# Altium project dc-dc.PrjPcb
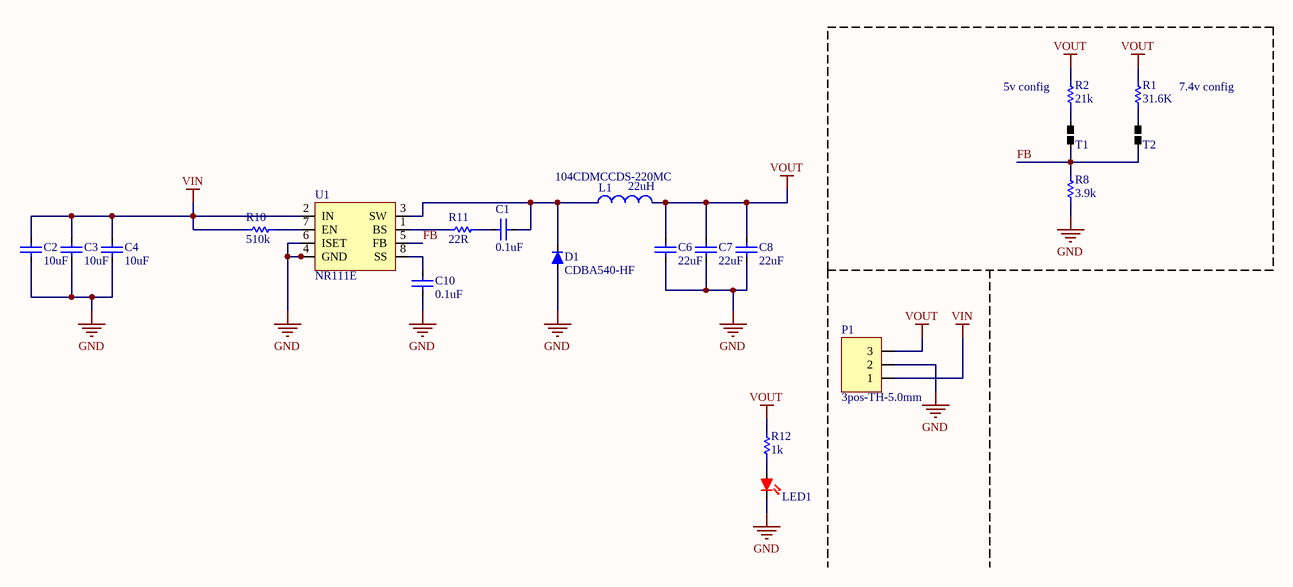
[diagram p0: Sheet1.SchDoc]
1 sheet, 21 parts. Net scope: global (net labels, ports and power ports of the same name join across sheets).
Board file: PCB1.PcbDoc

## Sheet Sheet1.SchDoc
size A4

### Parts
C1  value 0.1uF  [CAPACITOR-0603]  (hidden comment: Capacitor-0603-0.1uF-50V-X7R)
C2  value 10uF  [CAPACITOR-0805]  (hidden comment: Capacitor-0805-10uF-35V-X5R)
C3  value 10uF  [CAPACITOR-0805]  (hidden comment: Capacitor-0805-10uF-35V-X5R)
C4  value 10uF  [CAPACITOR-0805]  (hidden comment: Capacitor-0805-10uF-35V-X5R)
C6  value 22uF  [CAPACITOR-0805]  (hidden comment: Capacitor-0805-22uF-16V-X5R)
C7  value 22uF  [CAPACITOR-0805]  (hidden comment: Capacitor-0805-22uF-16V-X5R)
C8  value 22uF  [CAPACITOR-0805]  (hidden comment: Capacitor-0805-22uF-16V-X5R)
C10  value 0.1uF  [CAPACITOR-0603]  (hidden comment: Capacitor-0603-0.1uF-50V-X7R)
D1  CDBA540-HF  [SMA/DO-214AC]
L1  104CDMCCDS-220MC  value 22uH  [Inductor_22UH 5A]
LED1  B1911USD-20D000114U1930  [LED-0603-2PIN]  (value not drawn)
P1  3pos-TH-5.0mm  [Side Connector 3pins]
R1  value 31.6K  [Resistor-0603]  (hidden comment: SMT resistor)
R2  value 21k  [Resistor-0603]  (hidden comment: SMT resistor)
R8  value 3.9k  [Resistor-0603]  (hidden comment: SMT resistor)
R10  value 510k  [Resistor-0603]  (hidden comment: SMT resistor)
R11  value 22R  [Resistor-0603]  (hidden comment: SMT resistor)
R12  value 1k  [Resistor-0603]  (hidden comment: SMT resistor)
T1  NetTie_0402  [NetTie-0402]  (value not drawn)
T2  NetTie_0402  [NetTie-0402]  (value not drawn)
U1  NR111E  [SOIC-8-EXPOSED-PAD]

### Nets
GND: C2.1 C3.1 C4.1 C6.1 C7.1 C8.1 C10.2 D1.1(A) LED1.1(K) P1.2 R8.1 U1.4(GND) U1.6(ISET) U1.9(GND)
VIN: C2.2 C3.2 C4.2 P1.1 R10.1 U1.2(IN)
VOUT: C6.2 C7.2 C8.2 L1.2 P1.3 R1.2 R2.2 R12.2
FB: R8.2 T1.2 T2.2 U1.5(FB)
NetC1_1: C1.1 R11.2
NetC1_2: C1.2 D1.2(K) L1.1 U1.3(SW)
NetC10_1: C10.1 U1.8(SS)
NetLED1_2: LED1.2(R) R12.1
NetR1_1: R1.1 T2.1
NetR2_1: R2.1 T1.1
NetR10_2: R10.2 U1.7(EN)
NetR11_1: R11.1 U1.1(BS)

### Notes on the sheet
- (near R2) 5v config
- 7.4v config

### Library data of the parts
C1 C10 = Capacitor-0603-0.1uF-50V-X7R: Precision: X7R-10%; Volt: 50V; Package / Case: Metric 1608, EIA 0603; Mounted: Yes; Supplier 1: Digi-Key; Supplier Part Number 1: 1276-1935-2-ND; Supplier 2: Digi-Key; Supplier 3: Digi-Key; Supplier 4: Digi-Key; Supplier Part Number 2: 1276-1934-2-ND
C2-C4 = Capacitor-0805-10uF-35V-X5R: Precision: X5R-10%; Volt: 35V; Package / Case: Metric 2012 , EIA 0805; Mounted: Yes; Supplier 1: Digi-Key; Supplier Part Number 1: 490-10515-1-ND; Supplier 2: Digi-Key; Supplier 3: Digi-Key; Supplier 4: Digi-Key
C6-C8 = Capacitor-0805-22uF-16V-X5R: Precision: X5R-10%; Volt: 16V; Package / Case: Metric 2012 , EIA 0805; Mounted: Yes; Supplier 1: Digi-Key; Supplier Part Number 1: 1276-6780-1-ND; Supplier 2: Digi-Key; Supplier 3: Digi-Key; Supplier 4: Digi-Key
D1 = CDBA540-HF: DIODE SCHOTTKY 40V 5A SMA; Supplier 1: Digi-Key; Supplier Part Number 1: 641-1707-1-ND; Mounted: Yes; Package / Case: SMA; Volt: 40V
L1 = 104CDMCCDS-220MC: FIXED IND 22UH 5A 66 MOHM SMD; Precision: 20%; Supplier 1: Digi-Key; Mounted: Yes; Supplier Part Number 1: 308-2498-1-ND; Package / Case: SMD; Current: 5A
LED1 = B1911USD-20D000114U1930: LED RED CLEAR 1608 SMD; Package / Case: 0603 (1608 Metric); Mounted: Yes; Supplier 1: Digi-Key; Supplier Part Number 1: 3147-B1911USD-20D000114U1930CT-ND
P1 = 3pos-TH-5.0mm: 3pos-TH-5.0mm Screw Terminal; Supplier 1: Digi-Key; Supplier Part Number 1: 277-1667-ND; Mounted: Yes; Package / Case: TH; Volt: N/A
R1 R2 = Resistor0603-21k: Resistor; Precision: 1%; Watt: 0.1W; Mounted: Yes; Package / Case: Metric 1608, EIA 0603; Supplier 2: Digi-Key; Supplier 4: Digi-Key; Supplier 1: Digi-Key; Supplier 3: Digi-Key; Supplier Part Number 1: 311-21.0KHRCT-ND
R8 = Resistor0603-3.9k: Resistor; Precision: 1%; Watt: 0.1W; Mounted: Yes; Package / Case: Metric 1608, EIA 0603; Supplier 2: Digi-Key; Supplier 4: Digi-Key; Supplier 1: Digi-Key; Supplier 3: Digi-Key; Supplier Part Number 1: 311-3.90KHRCT-ND
R10 = Resistor0603-510k: Resistor; Precision: 1%; Watt: 0.1W; Mounted: Yes; Package / Case: Metric 1608, EIA 0603; Supplier 2: Digi-Key; Supplier 4: Digi-Key; Supplier 1: Digi-Key; Supplier 3: Digi-Key; Supplier Part Number 1: P510KHCT-ND
R11 = Resistor0603-22R: Resistor; Precision: 1%; Watt: 0.1W; Mounted: Yes; Package / Case: Metric 1608, EIA 0603; Supplier 2: Digi-Key; Supplier 4: Digi-Key; Supplier 1: Digi-Key; Supplier 3: Digi-Key; Supplier Part Number 1: RMCF0603FT22R0CT-ND
R12 = Resistor0603-1k: Resistor; Precision: 1%; Watt: 0.1W; Mounted: Yes; Package / Case: Metric 1608, EIA 0603; Supplier 2: Digi-Key; Supplier 4: Digi-Key; Supplier Part Number 2: 311-1.00KHRTR-ND; Supplier 1: Digi-Key; Supplier 3: Digi-Key; Supplier Part Number 1: RMCF0603FT1K00TR-ND; Supplier Part Number 3: AG1307TR-ND
U1 = NR111E: IC REG BUCK ADJUSTABLE 4A 8SOIC; Grade: None; Supplier 1: Digi-Key; Supplier Part Number 1: NR111ECT-ND; HelpURL: https://www.digikey.ca/en/products/detail/sanken/NR111E/4289131; Package / Case: 8-SOIC-EP; Mounted: Yes